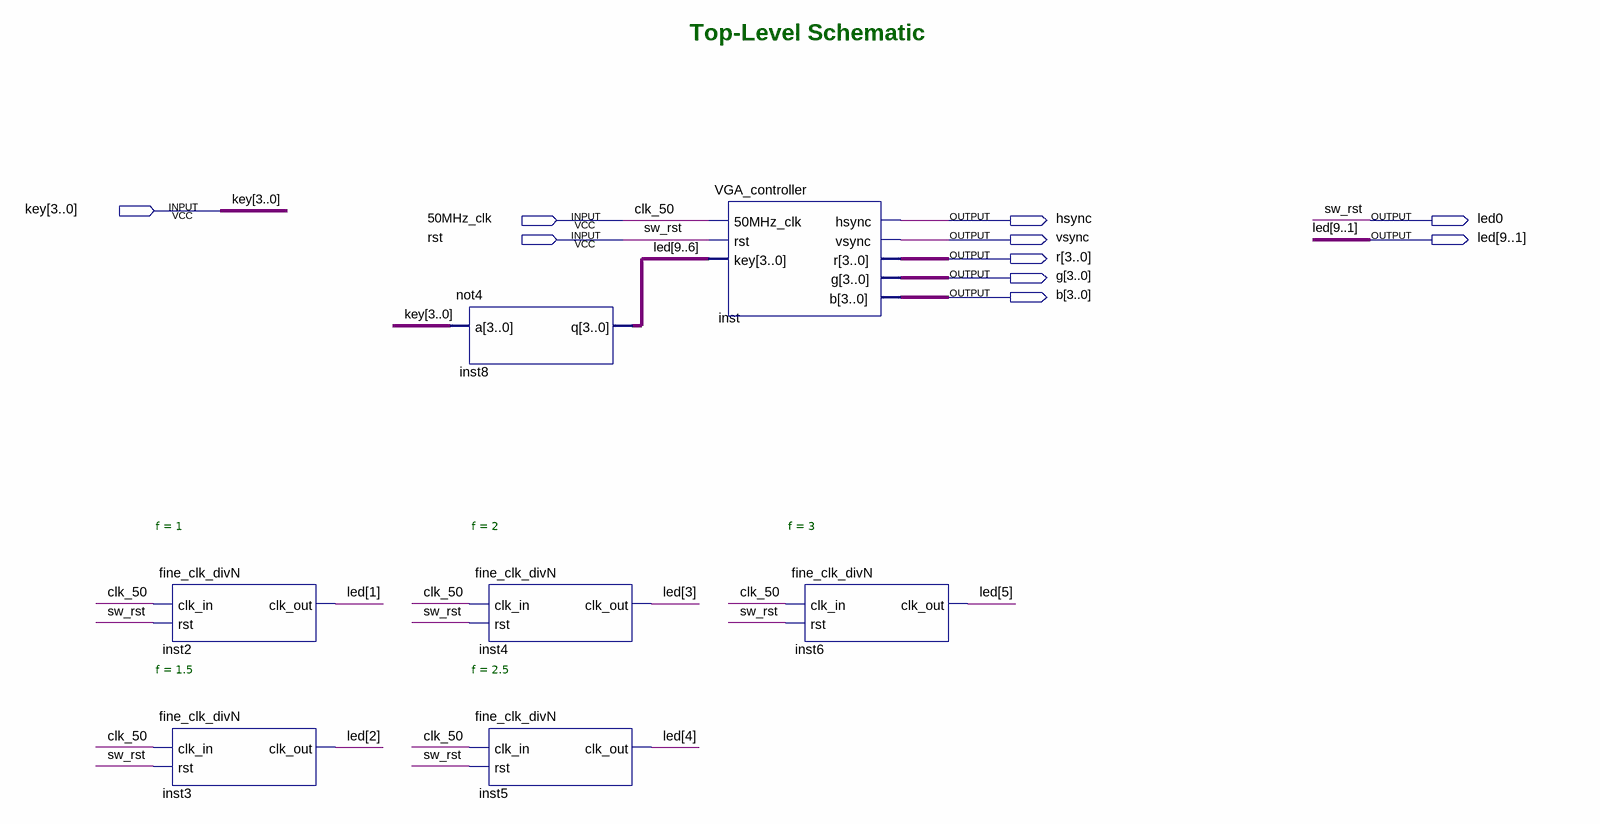
[diagram p0: schematic sheet]
// Quartus schematic TopLevel.bdf as structural Verilog: 7 symbols, 10 pins
module TopLevel (
  input  [3:0] key,
  input  \50MHz_clk ,
  input  rst,
  output hsync,
  output led0,
  output vsync,
  output [9:1] led,
  output [3:0] r,
  output [3:0] g,
  output [3:0] b
);

  fine_clk_divN #(.f(1)) inst2 (.clk_in(\50MHz_clk ), .rst(rst), .clk_out(led[1]));
  fine_clk_divN #(.f(1.5)) inst3 (.clk_in(\50MHz_clk ), .rst(rst), .clk_out(led[2]));
  not4 inst8 (.a(key), .q(led[9:6]));
  fine_clk_divN #(.f(2)) inst4 (.clk_in(\50MHz_clk ), .rst(rst), .clk_out(led[3]));
  fine_clk_divN #(.f(2.5)) inst5 (.clk_in(\50MHz_clk ), .rst(rst), .clk_out(led[4]));
  VGA_controller inst (
    .\50MHz_clk (\50MHz_clk ), .rst(rst), .key(led[9:6]), .hsync(hsync), .vsync(vsync), .r(r), .g(g), .b(b));
  fine_clk_divN #(.f(3)) inst6 (.clk_in(\50MHz_clk ), .rst(rst), .clk_out(led[5]));

  assign led0 = rst;

  // Other names for the same wires on the sheet: clk_50 = \50MHz_clk ; sw_rst = rst

  // Notes on the sheet:
  //   Top-Level Schematic
endmodule
